# Altium project Maverick.PrjPCB
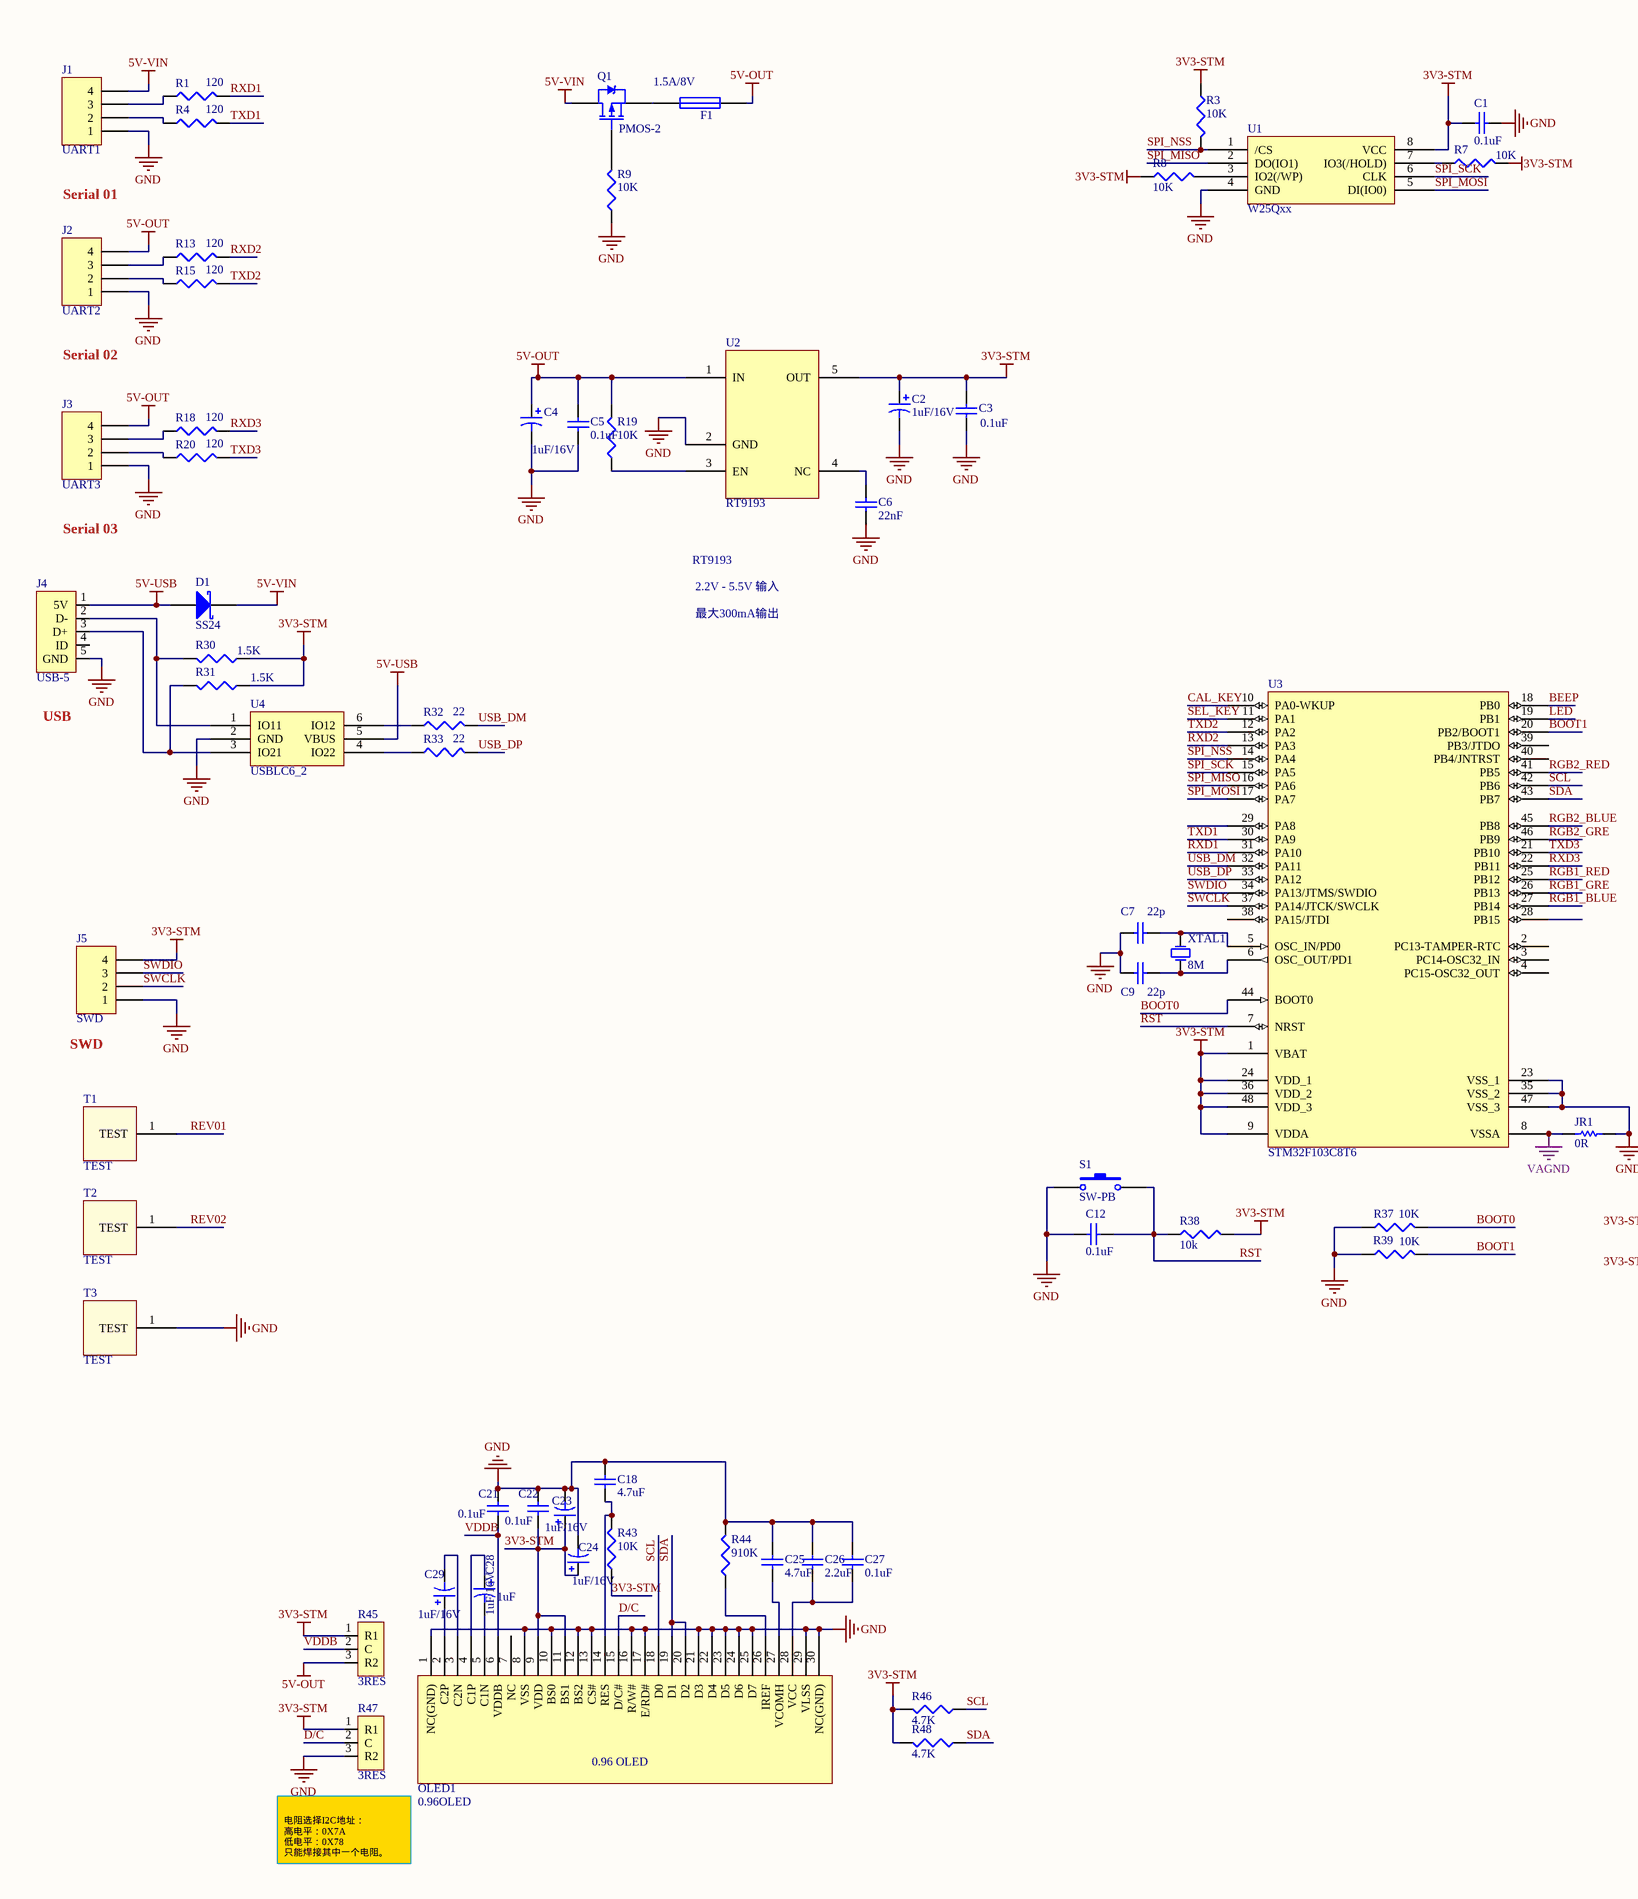
[diagram p0: MavSword_V1.0.SchDoc, left]
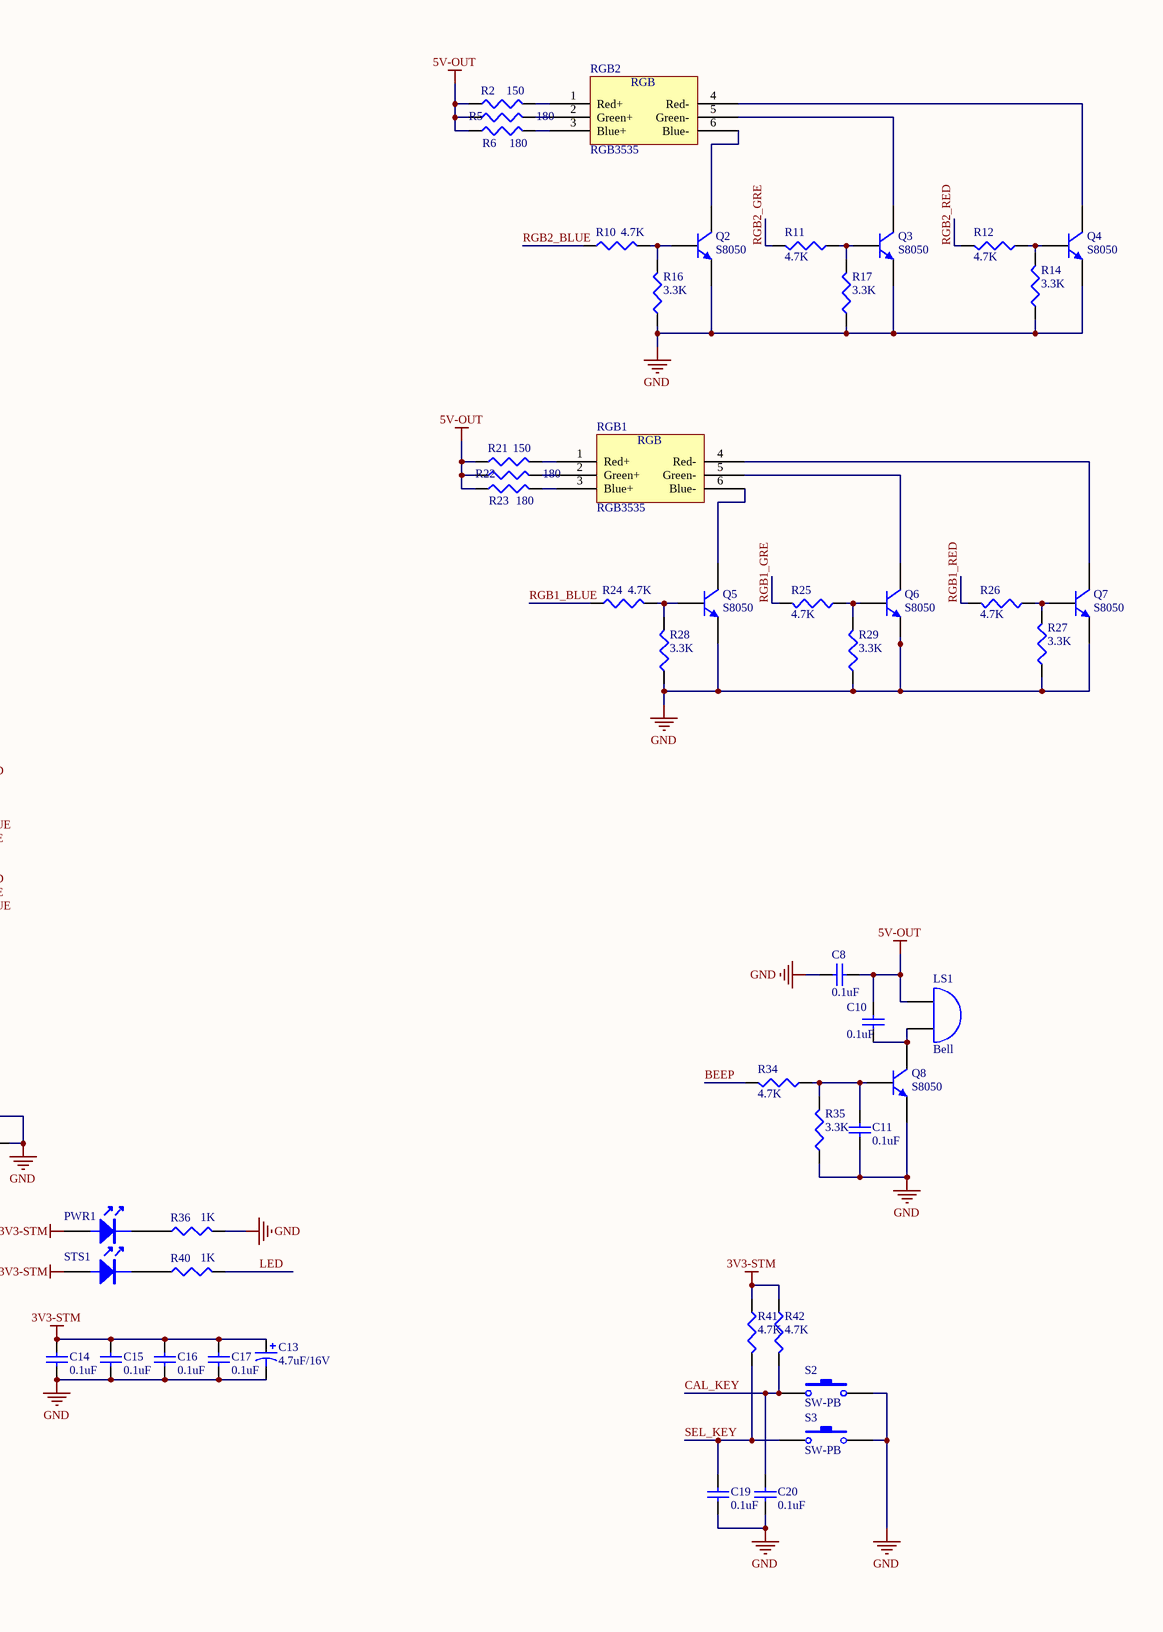
[diagram p1: MavSword_V1.0.SchDoc, right]
3 sheets, 240 parts. Net scope: global (net labels, ports and power ports of the same name join across sheets).
Board files: MavSword_V1.0.PcbDoc, car_V1.0.PcbDoc, hotV1.1.PcbDoc
Sheets:
  MavSword_V1.0.SchDoc
  hotV1.1.SchDoc
  Car.SchDoc

## Sheet MavSword_V1.0.SchDoc: MavSword
size A2; Author: AwesomeOY; DocumentNumber: 1; Revision: V1.0; SheetNumber: 1; SheetTotal: MavSword

### Parts
(Parts that share a designator on the sheet are numbered #1, #2 ... from top to bottom, then left to right.)
C1#1  0.1uF  [C0603B]
C2#1  1uF/16V  [C0603B]
C3#1  0.1uF  [C0603B]
C4#1  1uF/16V  [C0603B]
C5#1  0.1uF  [C0603B]
C6#1  22nF  [C0603B]
C7#1  22p  [C0603B]
C8#1  0.1uF  [C0603B]
C9#1  22p  [C0603B]
C10#1  0.1uF  [C0603B]
C11#1  0.1uF  [C0603B]
C12#1  0.1uF  [C0603B]
C13#1  4.7uF/16V  [C0603B]
C14#1  0.1uF  [C0603B]
C15#1  0.1uF  [C0603B]
C16#1  0.1uF  [C0603B]
C17#1  0.1uF  [C0603B]
C18#1  4.7uF  [C0603B]
C19#1  0.1uF  [C0603B]
C20#1  0.1uF  [C0603B]
C21#1  0.1uF  [C0603B]
C22#1  value 1uF/16V  [C0603B]  (hidden comment: 0.1uF)
C23#1  0.1uF  [C0603B]
C24#1  value 1uF/16V  [C0603B]  (hidden comment: Cap Pol1)
C25#1  4.7uF  [C0603B]
C26#1  2.2uF  [C0603B]
C27#1  0.1uF  [C0603B]
C28#1  1uF  value 1uF/16V  [C0603B]
C29#1  value 1uF/16V  [C0603B]  (hidden comment: Cap Pol1)
D1#1  SS24  [D1812]
F1#1  1.5A/8V  [1812]
J1#1  UART1  [SIPA4-1.27-SMT-H]
J2#1  UART2  [SIPA4-1.27-SMT-H]
J3#1  UART3  [SIPA4-1.27-SMT-H]
J4#1  USB-5  [MICRO-USB]
J5#1  SWD  [SIP4-1.27]
JR1#1  0R  [R0603B]
LS1#1  Bell  [BEEP12*7.5]
OLED1  0.96OLED  [0.96OLED]
PWR1#1  LED  [LED0805R]  (value not drawn)
Q1#1  PMOS-2  [SOT-23-3]
Q2#1  S8050  [SOT-23-3]
Q3#1  S8050  [SOT-23-3]
Q4#1  S8050  [SOT-23-3]
Q5#1  S8050  [SOT-23-3]
Q6  S8050  [SOT-23-3]
Q7  S8050  [SOT-23-3]
Q8  S8050  [SOT-23-3]
R1#1  120  [R0603B]
R2#1  150  [R0603B]
R3#1  10K  [R0603B]
R4#1  120  [R0603B]
R5#1  180  [R0603B]
R6#1  180  [R0603B]
R7#1  10K  [R0603B]
R8#1  10K  [R0603B]
R9#1  10K  [R0603B]
R10#1  4.7K  [R0603B]
R11  4.7K  [R0603B]
R12#1  4.7K  [R0603B]
R13#1  120  [R0603B]
R14#1  3.3K  [R0603B]
R15#1  120  [R0603B]
R16#1  3.3K  [R0603B]
R17#1  3.3K  [R0603B]
R18#1  120  [R0603B]
R19#1  10K  [R0603B]
R20#1  120  [R0603B]
R21#1  150  [R0603B]
R22#1  180  [R0603B]
R23#1  180  [R0603B]
R24#1  4.7K  [R0603B]
R25#1  4.7K  [R0603B]
R26#1  4.7K  [R0603B]
R27#1  3.3K  [R0603B]
R28#1  3.3K  [R0603B]
R29#1  3.3K  [R0603B]
R30#1  1.5K  [R0603B]
R31#1  1.5K  [R0603B]
R32#1  22  [R0603B]
R33#1  22  [R0603B]
R34#1  4.7K  [R0603B]
R35#1  3.3K  [R0603B]
R36#1  1K  [R0603B]
R37#1  10K  [R0603B]
R38#1  10k  [R0603B]
R39#1  10K  [R0603B]
R40#1  1K  [R0603B]
R41#1  4.7K  [R0603B]
R42#1  4.7K  [R0603B]
R43#1  10K  [R0603B]
R44  910K  [R0603B]
R45  3RES  [3JUMP0603*2]
R46  4.7K  [R0603B]
R47  3RES  [3JUMP0603*2]
R48  4.7K  [R0603B]
RGB1  RGB3535  [RGB3535]
RGB2  RGB3535  [RGB3535]
S1#1  SW-PB  [SW2PIN_8.2*3.5]
S2#1  SW-PB  [SW4PIN_9.2*6.15*9]
S3  SW-PB  [SW4PIN_9.2*6.15*9]
STS1#1  LED  [LED0805G]  (value not drawn)
T1#1  TEST  [TEST_POINT]
T2#1  TEST  [TEST_POINT]
T3#1  TEST  [TEST_POINT]
U1#1  W25Qxx  [SOIC-8_208mil]
U2#1  RT9193  [SOT23-5]
U3#1  STM32F103C8T6  [LQFP48_M_STM32]
U4#1  USBLC6_2  [SOT-23-6]
XTAL1#1  8M  [XL5032]

### Nets
3V3-STM: C1#1.2 C2#1.1 C3#1.1 C13#1.1 C14#1.2 C15#1.2 C16#1.2 C17#1.2 C22#1.1 C23#1.1 C24#1.1 J5#1.4 OLED1.9(VDD) OLED1.11(BS1) PWR1#1.1 R3#1.1 R7#1.2 R8#1.1 R30#1.1 R31#1.1 R38#1.1 R41#1.1 R42#1.1 R43#1.1 R45.1(R1) R46.2 R47.1(R1) R48.2 STS1#1.1 U1#1.8(VCC) U2#1.5(OUT) U3#1.1(VBAT) U3#1.9(VDDA) U3#1.24(VDD_1) U3#1.36(VDD_2) U3#1.48(VDD_3)
5V-OUT: C4#1.1 C5#1.2 C8#1.2 C10#1.2 F1#1.2 J2#1.4 J3#1.4 LS1#1.1(A) R2#1.1 R5#1.1 R6#1.1 R19#1.2 R21#1.1 R22#1.1 R23#1.1 R45.3(R2) U2#1.1(IN)
5V-USB: D1#1.1(A) J4#1.1(5V) U4#1.5(VBUS)
5V-VIN: D1#1.2(K) J1#1.4 Q1#1.2(D)
GND: C1#1.1 C2#1.2 C3#1.2 C4#1.2 C5#1.1 C6#1.1 C7#1.2 C8#1.1 C9#1.2 C11#1.1 C12#1.1 C13#1.2 C14#1.1 C15#1.1 C16#1.1 C17#1.1 C18#1.2 C19#1.1 C20#1.1 C21#1.2 C22#1.2 C23#1.2 C24#1.2 C25#1.2 C26#1.2 C27#1.1 J1#1.1 J2#1.1 J3#1.1 J4#1.5(GND) J5#1.1 JR1#1.2 OLED1.1(NC(GND)) OLED1.8(VSS) OLED1.10(BS0) OLED1.12(BS2) OLED1.13(CS#) OLED1.16(R/W#) OLED1.17(E/RD#) OLED1.21(D3) OLED1.22(D4) OLED1.23(D5) OLED1.24(D6) OLED1.25(D7) OLED1.29(VLSS) OLED1.30(NC(GND)) Q2#1.3(E) Q3#1.3(E) Q4#1.3(E) Q5#1.3(E) Q6.3(E) Q7.3(E) Q8.3(E) R9#1.1 R14#1.1 R16#1.1 R17#1.1 R27#1.1 R28#1.1 R29#1.1 R35#1.1 R36#1.2 R37#1.1 R39#1.1 R44.2 R47.3(R2) S1#1.1 S2#1.2 S3.2 T3#1.1(TEST) U1#1.4(GND) U2#1.2(GND) U3#1.23(VSS_1) U3#1.35(VSS_2) U3#1.47(VSS_3) U4#1.2(GND)
VAGND: JR1#1.1 U3#1.8(VSSA)
BEEP: R34#1.2 U3#1.18(PB0)
BOOT0: R37#1.2 U3#1.44(BOOT0)
BOOT1: R39#1.2 U3#1.20(PB2/BOOT1)
CAL_KEY: C20#1.2 R42#1.2 S2#1.1 U3#1.10(PA0-WKUP)
D/C: OLED1.15(D/C#) R47.2(C)
LED: R40#1.2 U3#1.19(PB1)
REV01: T1#1.1(TEST)
REV02: T2#1.1(TEST)
RGB1_BLUE: R24#1.1 U3#1.27(PB14)
RGB1_GRE: R25#1.2 U3#1.26(PB13)
RGB1_RED: R26#1.2 U3#1.25(PB12)
RGB2_BLUE: R10#1.1 U3#1.45(PB8)
RGB2_GRE: R11.2 U3#1.46(PB9)
RGB2_RED: R12#1.2 U3#1.41(PB5)
RST: C12#1.2 R38#1.2 S1#1.2 U3#1.7(NRST)
RXD1: R1#1.2 U3#1.31(PA10)
RXD2: R13#1.2 U3#1.13(PA3)
RXD3: R18#1.2 U3#1.22(PB11)
SCL: OLED1.18(D0) R46.1 U3#1.42(PB6)
SDA: OLED1.19(D1) OLED1.20(D2) R48.1 U3#1.43(PB7)
SEL_KEY: C19#1.2 R41#1.2 S3.1 U3#1.11(PA1)
SPI_MISO: U1#1.2(DO(IO1)) U3#1.16(PA6)
SPI_MOSI: U1#1.5(DI(IO0)) U3#1.17(PA7)
SPI_NSS: R3#1.2 U1#1.1(/CS) U3#1.14(PA4)
SPI_SCK: U1#1.6(CLK) U3#1.15(PA5)
SWCLK: J5#1.2 U3#1.37(PA14/JTCK/SWCLK)
SWDIO: J5#1.3 U3#1.34(PA13/JTMS/SWDIO)
TXD1: R4#1.2 U3#1.30(PA9)
TXD2: R15#1.2 U3#1.12(PA2)
TXD3: R20#1.2 U3#1.21(PB10)
USB_DM: R32#1.2 U3#1.32(PA11)
USB_DP: R33#1.2 U3#1.33(PA12)
VDDB: C21#1.1 OLED1.6(VDDB) R45.2(C)
NetC6#1_2: C6#1.2 U2#1.4(NC)
NetC7#1_1: C7#1.1 U3#1.5(OSC_IN/PD0) XTAL1#1.2(OSC2)
NetC9#1_1: C9#1.1 U3#1.6(OSC_OUT/PD1) XTAL1#1.1(OSC1)
NetC10#1_1: C10#1.1 LS1#1.2(B) Q8.2(C)
NetC11#1_2: C11#1.2 Q8.1(B) R34#1.1 R35#1.2
NetC18#1_1: C18#1.1 OLED1.14(RES) R43#1.2
NetC25#1_1: C25#1.1 OLED1.27(VCOMH)
NetC26#1_1: C26#1.1 C27#1.2 OLED1.28(VCC)
NetC28#1_1: C28#1.1 OLED1.4(C1P)
NetC28#1_2: C28#1.2 OLED1.5(C1N)
NetC29#1_1: C29#1.1 OLED1.2(C2P)
NetC29#1_2: C29#1.2 OLED1.3(C2N)
NetF1#1_1: F1#1.1 Q1#1.3(S)
NetJ1#1_2: J1#1.2 R4#1.1
NetJ1#1_3: J1#1.3 R1#1.1
NetJ2#1_2: J2#1.2 R15#1.1
NetJ2#1_3: J2#1.3 R13#1.1
NetJ3#1_2: J3#1.2 R20#1.1
NetJ3#1_3: J3#1.3 R18#1.1
NetJ4#1_2: J4#1.2(D-) R30#1.2 U4#1.1(IO11)
NetJ4#1_3: J4#1.3(D+) R31#1.2 U4#1.3(IO21)
NetOLED1_26: OLED1.26(IREF) R44.1
NetPWR1#1_2: PWR1#1.2 R36#1.1
NetQ1#1_1: Q1#1.1(G) R9#1.2
NetQ2#1_1: Q2#1.1(B) R10#1.2 R16#1.2
NetQ2#1_2: Q2#1.2(C) RGB2.6(Blue-)
NetQ3#1_1: Q3#1.1(B) R11.1 R17#1.2
NetQ3#1_2: Q3#1.2(C) RGB2.5(Green-)
NetQ4#1_1: Q4#1.1(B) R12#1.1 R14#1.2
NetQ4#1_2: Q4#1.2(C) RGB2.4(Red-)
NetQ5#1_1: Q5#1.1(B) R24#1.2 R28#1.2
NetQ5#1_2: Q5#1.2(C) RGB1.6(Blue-)
NetQ6_1: Q6.1(B) R25#1.1 R29#1.2
NetQ6_2: Q6.2(C) RGB1.5(Green-)
NetQ7_1: Q7.1(B) R26#1.1 R27#1.2
NetQ7_2: Q7.2(C) RGB1.4(Red-)
NetR2#1_2: R2#1.2 RGB2.1(Red+)
NetR5#1_2: R5#1.2 RGB2.2(Green+)
NetR6#1_2: R6#1.2 RGB2.3(Blue+)
NetR7#1_1: R7#1.1 U1#1.7(IO3(/HOLD))
NetR8#1_2: R8#1.2 U1#1.3(IO2(/WP))
NetR19#1_1: R19#1.1 U2#1.3(EN)
NetR21#1_2: R21#1.2 RGB1.1(Red+)
NetR22#1_2: R22#1.2 RGB1.2(Green+)
NetR23#1_2: R23#1.2 RGB1.3(Blue+)
NetR32#1_1: R32#1.1 U4#1.6(IO12)
NetR33#1_1: R33#1.1 U4#1.4(IO22)
NetR40#1_1: R40#1.1 STS1#1.2

Not connected (* = marked no-connect by the designer): J4#1 4(ID); OLED1 7(NC); U3#1 2(PC13-TAMPER-RTC) 3(PC14-OSC32_IN) 4(PC15-OSC32_OUT) 28(PB15) 29(PA8) 38(PA15/JTDI) 39(PB3/JTDO) 40(PB4/JNTRST)

### Notes on the sheet
- Serial 01
- Serial 02
- Serial 03
- RT9193
  2.2V - 5.5V 输入
  最大300mA输出
- (near J4#1) USB
- (near J5#1) SWD
- (near R47) 电阻选择I2C地址：
  高电平：0X7A
  低电平：0X78
  只能焊接其中一个电阻。
- Title
- Size:
- Date:
- File:
- A2
- Number:
- Time:
- Revision:
- Sheet
- of
- (in symbol 0.96OLED) 0.96 OLED
- (in symbol RGB3535) RGB

### Library data of the parts
C1#1 C3#1 C5#1 C6#1 C8#1 C10#1 C11#1 C12#1 C14#1 C15#1 C16#1 C17#1 C19#1 C20#1 C21#1 C23#1 C27#1 = Cap: Capacitor; Published: 8-Jun-2000; LatestRevisionDate: 17-Jul-2002; LatestRevisionNote: Re-released for DXP Platform.; PackageReference: RAD-0.3; Publisher: Altium Limited
  C1#1 C3#1 C5#1 C8#1 C10#1 C11#1 C12#1 C14#1 C15#1 C16#1 C17#1 C19#1 C20#1 C21#1 C23#1 C27#1: Value: 0.1uF
  C6#1: Value: 22nF
C2#1 C4#1 C13#1 C22#1 C24#1 C28#1 C29#1 = Cap Pol1: Polarized Capacitor (Radial); Published: 8-Jun-2000; LatestRevisionDate: 17-Jul-2002; LatestRevisionNote: Re-released for DXP Platform.; PackageReference: RB7.6-15; Publisher: Altium Limited
  C2#1 C4#1: Value: 1uF/16V
  C13#1: Value: 4.7uF/16V
  C22#1 C24#1 C28#1 C29#1: PackageDescription: Polarized Capacitor (Radial); 2 Leads
C7#1 C9#1 = Cap: Capacitor; Value: 22pF; Published: 8-Jun-2000; LatestRevisionDate: 17-Jul-2002; LatestRevisionNote: Re-released for DXP Platform.; PackageReference: RAD-0.3; Publisher: Altium Limited
C18#1 C25#1 = Cap: Capacitor; Value: 4.7uF/16V; Published: 8-Jun-2000; LatestRevisionDate: 17-Jul-2002; LatestRevisionNote: Re-released for DXP Platform.; PackageReference: RAD-0.3; Publisher: Altium Limited
C26#1 = Cap: Capacitor; Value: 2.2uF/16V; Published: 8-Jun-2000; LatestRevisionDate: 17-Jul-2002; LatestRevisionNote: Re-released for DXP Platform.; PackageReference: RAD-0.3; Publisher: Altium Limited
D1#1 = D Schottky: Schottky Diode; Published: 8-Jun-2000; LatestRevisionDate: 17-Jul-2002; LatestRevisionNote: Re-released for DXP Platform.; PackageReference: SMB; Publisher: Altium Limited; PackageDescription: DO-214-AA/SMB; 2 C-Bend Leads; Body 5.3 x 3.6 mm, inc. leads (LxW); Code_JEDEC: DO-214-AA
F1#1 = Fuse 1: Fuse; Published: 8-Jun-2000; LatestRevisionDate: 17-Jul-2002; LatestRevisionNote: Re-released for DXP Platform.; PackageReference: PIN-W2/E2.8; Publisher: Altium Limited; PackageDescription: Thru-Hole; 2 Leads
J1#1 J2#1 J3#1 J5#1 = Header 4: Header, 4-Pin; LatestRevisionDate: 17-Jul-2002; LatestRevisionNote: Re-released for DXP Platform.; Publisher: Altium Limited
J4#1 = USB5
JR1#1 = Res1: Resistor; Value: 0; Published: 8-Jun-2000; LatestRevisionDate: 17-Jul-2002; LatestRevisionNote: Re-released for DXP Platform.; PackageReference: AXIAL-0.3; Publisher: Altium Limited; PackageDescription: Axial Device, Thru-Hole; 2 Leads; 0.3 in Pin Spacing
LS1#1 = Bell: Electrical Bell; Published: 24-Mar-1999; LatestRevisionDate: 17-Jul-2002; LatestRevisionNote: Re-released for DXP Platform.; PackageReference: PIN2; Publisher: Altium Limited
Q1#1 = PMOS-2: P-Channel Power MOSFET; Note: Pin 4 not drawn and electrically connected to Pin 2.; Published: 8-Jun-2000; LatestRevisionDate: 17-Jul-2002; LatestRevisionNote: Re-released for DXP Platform.; DatasheetVersion: PD-9.390D; PackageVersion: Feb-1997; PackageReference: TO-220AB; Publisher: Altium Limited; PackageDescription: TO, Thru-Hole, Vertical, Heatsink Mounted; 3 In-Line Leads; Pitch 2.54 mm; ComponentLink1Description: Manufacturer Link; ComponentLink1URL: http://www.irf.com/
Q2#1 Q3#1 Q4#1 Q5#1 Q6-Q8 = NPN: NPN Bipolar Transistor; Published: 8-Jun-2000; LatestRevisionDate: 17-Jul-2002; LatestRevisionNote: Re-released for DXP Platform.; PackageReference: TO-226-AA; Publisher: Altium Limited; PackageDescription: TO, Flat Index; 3 In-Line, Axial Leads; Body Dia. 4.8mm; Leads 0.55 x 0.51 mm (max); Code_JEDEC: TO-226-AA
R1#1 R2#1 R3#1 R4#1 R5#1 R6#1 R7#1 R8#1 R9#1 R10#1 R11 R12#1 R13#1 R14#1 R15#1 R16#1 R17#1 R18#1 R19#1 R20#1 R21#1 R22#1 R23#1 R24#1 R25#1 R26#1 R27#1 R28#1 R29#1 R30#1 R31#1 R32#1 R33#1 R34#1 R35#1 R36#1 R37#1 R38#1 R39#1 R40#1 R41#1 R42#1 R43#1 R44 R46 R48 = Res3: Resistor; Published: 8-Jun-2000; LatestRevisionDate: 29-May-2009; LatestRevisionNote: IPC-7351 Footprint Added.; PackageReference: J1-0603; Publisher: Altium Limited; PackageDescription: Chip Resistor
  R1#1 R4#1 R13#1 R15#1 R18#1 R20#1: Value: 120
  R2#1 R21#1: Value: 150
  R3#1 R7#1 R8#1 R9#1 R19#1 R37#1 R38#1 R39#1 R43#1: Value: 10K
  R5#1 R6#1 R22#1 R23#1: Value: 180
  R10#1 R11 R12#1 R24#1 R25#1 R26#1 R34#1 R41#1 R42#1 R46 R48: Value: 4.7K
  R14#1 R16#1 R17#1 R27#1 R28#1 R29#1 R35#1: Value: 3.3K
  R30#1 R31#1: Value: 1.5K
  R32#1 R33#1: Value: 22
  R36#1 R40#1: Value: 1K
  R44: Value: 910K
R45 = 3JumpR: value: 0
R47 = 3JumpR: value: 4.7
S1#1 S2#1 S3 = SW-PB: Switch; Published: 24-Mar-1999; LatestRevisionDate: 17-Jul-2002; LatestRevisionNote: Re-released for DXP Platform.; PackageReference: SPST-2; Publisher: Altium Limited; PackageDescription: Switch; 2 Leads
T1#1 T2#1 T3#1 = TEST_POINT
U2#1 = TLV70033
U3#1 = STM32F101C8T6: STM32 ARM-based 32-bit MCU with 64 Kbytes Flash, 48-pin LQFP, Industrial Temperature; Published: 30-May-2008; DatasheetVersion: rev6, Mar-2008; PackageVersion: Mar-2008; PackageReference: LQFP48; Publisher: Altium Limited; PackageDescription: 48-Pin Low-Profile Quad Flat Pack, 7 x 7 mm Body, 0.5 mm Pitch (LQFP48); ComponentLink1Description: Manufacturer Link; ComponentLink1URL: www.st.com/stm32; ComponentLink2Description: Datasheet; ComponentLink2URL: http://www.st.com/stonline/products/literature/ds/13586.pdf
XTAL1#1 = XTAL: Crystal Oscillator; Published: 8-Jun-2000; LatestRevisionDate: 17-Jul-2002; LatestRevisionNote: Re-released for DXP Platform.; PackageReference: R38; Publisher: Altium Limited

## Sheet hotV1.1.SchDoc
size A2
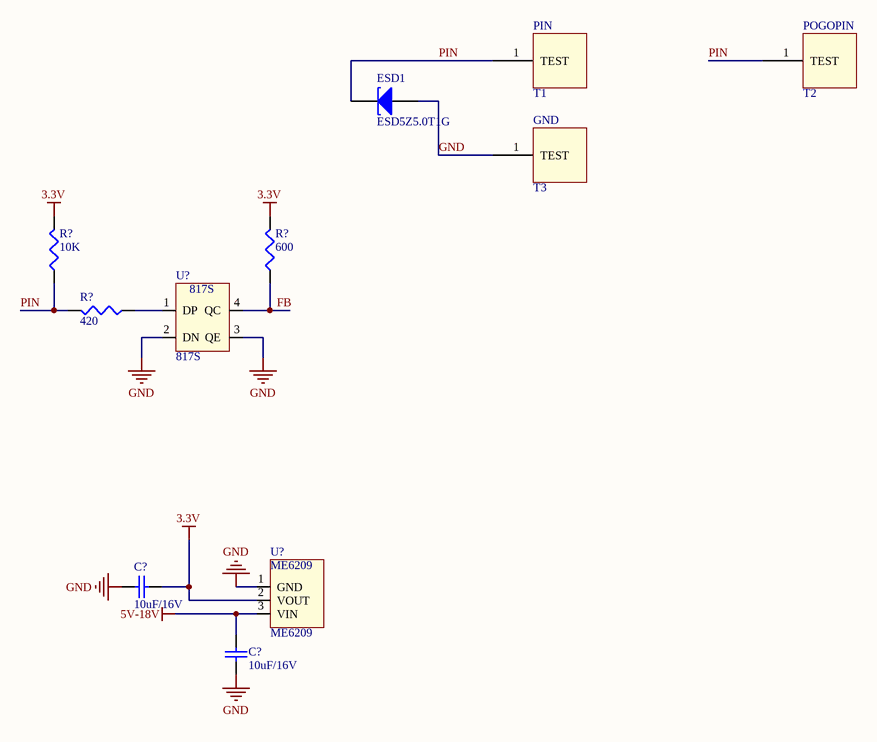
[diagram p2: hotV1.1.SchDoc]

### Parts
(Parts that share a designator on the sheet are numbered #1, #2 ... from top to bottom, then left to right.)
C?#1  10uF/16V  [C0603B]
C?#2  10uF/16V  [C0603B]
ESD1  ESD5Z5.0T1G  [LC-SOD-523]
GND  T3  [PIN]
PIN  T1  [PIN]
POGOPIN  T2  [POGOPIN]
R?#1  10K  [R0603B]
R?#2  600  [R0603B]
R?#3  420  [R0603B]
U?#1  817S
U?#2  ME6209

### Nets
3.3V: C?#1.1 R?#1.2 R?#2.2 U?#2.2(VOUT)
5V-18V: C?#2.2 U?#2.3(VIN)
GND: C?#1.2 C?#2.1 ESD1.1(A) GND.1(TEST) U?#1.2(DN) U?#1.3(QE) U?#2.1(GND)
FB: R?#2.1 U?#1.4(QC)
PIN: ESD1.2(K) PIN.1(TEST) POGOPIN.1(TEST) R?#1.1 R?#3.2
NetR?#3_1: R?#3.1 U?#1.1(DP)

### Library data of the parts
C?#1 C?#2 = Cap: Capacitor; Value: 0.1uF; Published: 8-Jun-2000; LatestRevisionDate: 17-Jul-2002; LatestRevisionNote: Re-released for DXP Platform.; PackageReference: RAD-0.3; Publisher: Altium Limited
ESD1 = D Tunnel2: Tunnel Diode - Dependent Source Model; Published: 15-Apr-2002; LatestRevisionDate: 17-Jul-2002; LatestRevisionNote: Re-released for DXP Platform.; PackageReference: DIODE-0.4; Publisher: Altium Limited; PackageDescription: Diode, Thru-Hole; 2 Leads; 0.4 in Pin Spacing
GND PIN POGOPIN = TEST_POINT
R?#1 = Res3: Resistor; Published: 8-Jun-2000; LatestRevisionDate: 29-May-2009; LatestRevisionNote: IPC-7351 Footprint Added.; PackageReference: J1-0603; Publisher: Altium Limited; Value: 10K; PackageDescription: Chip Resistor
R?#2 R?#3 = Res3: Resistor; Value: 10K; Published: 8-Jun-2000; LatestRevisionDate: 29-May-2009; LatestRevisionNote: IPC-7351 Footprint Added.; PackageReference: J1-0603; Publisher: Altium Limited; PackageDescription: Chip Resistor
U?#1 = 817S: 光耦芯片
U?#2 = ME6209: LDO芯片   VIN-16V OUT-3.3V  200ma

## Sheet Car.SchDoc
size A2
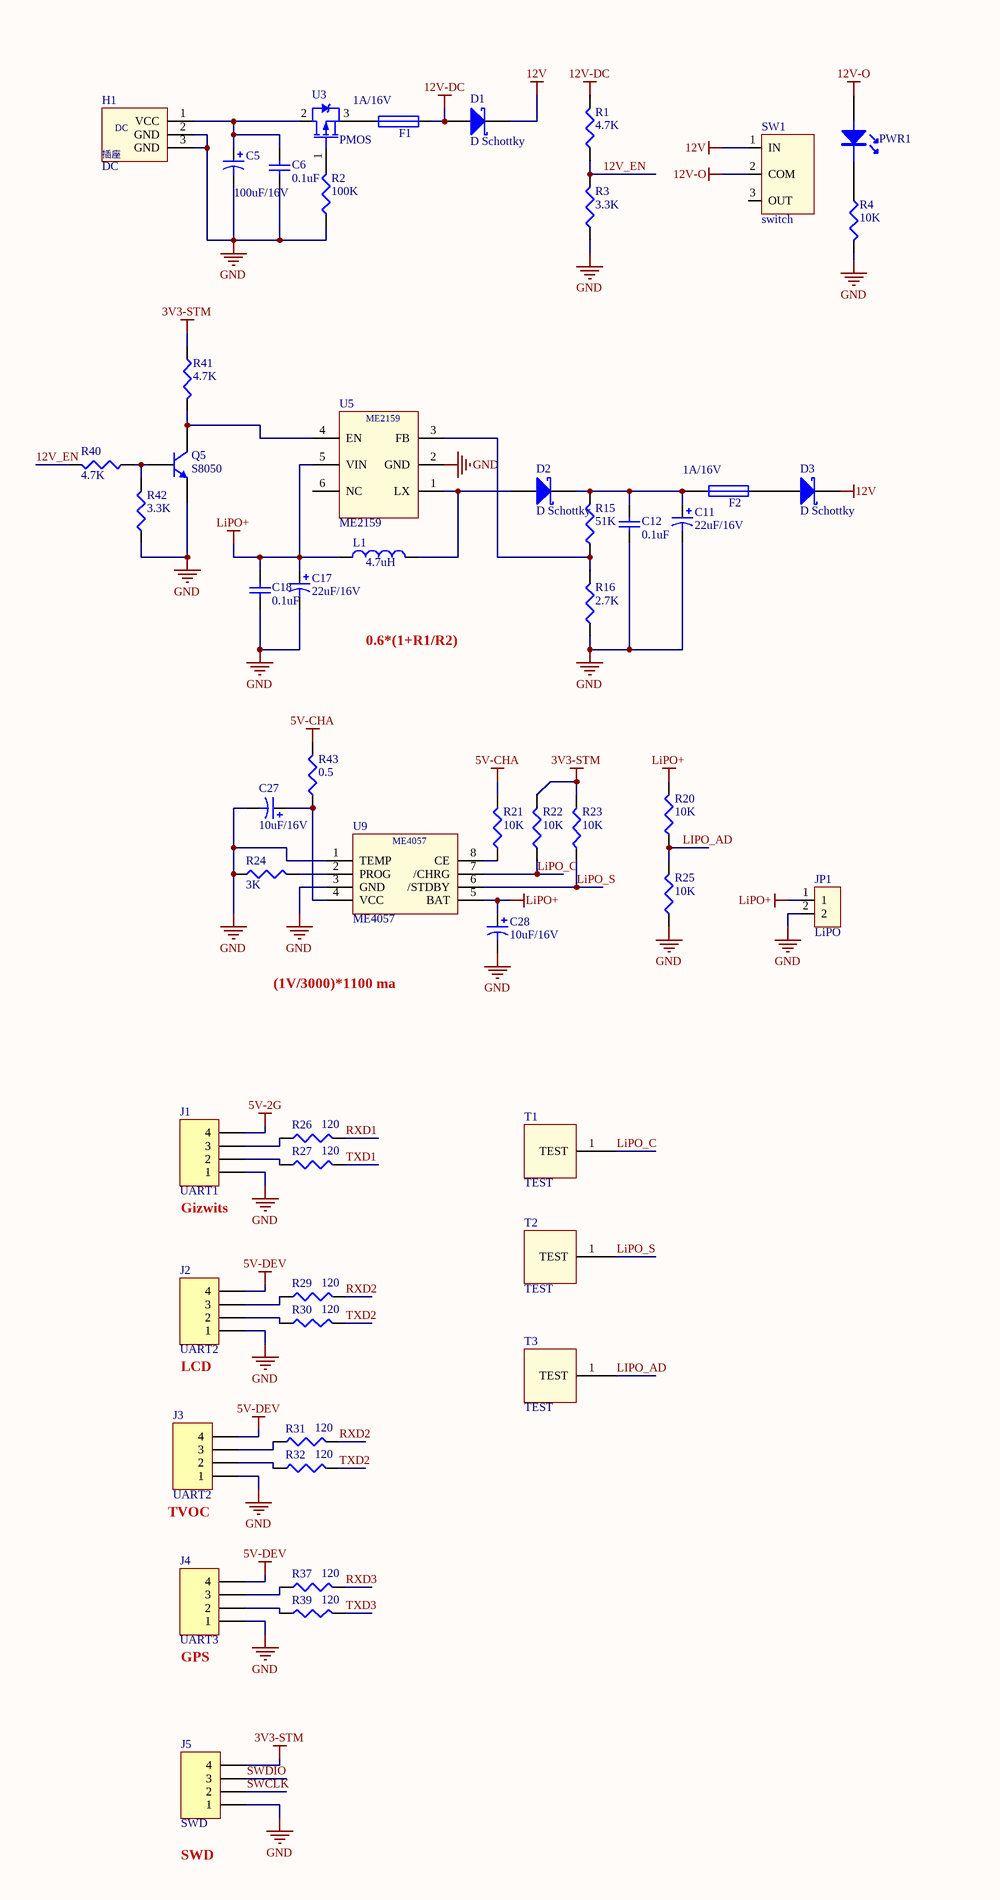
[diagram p3: Car.SchDoc, left]
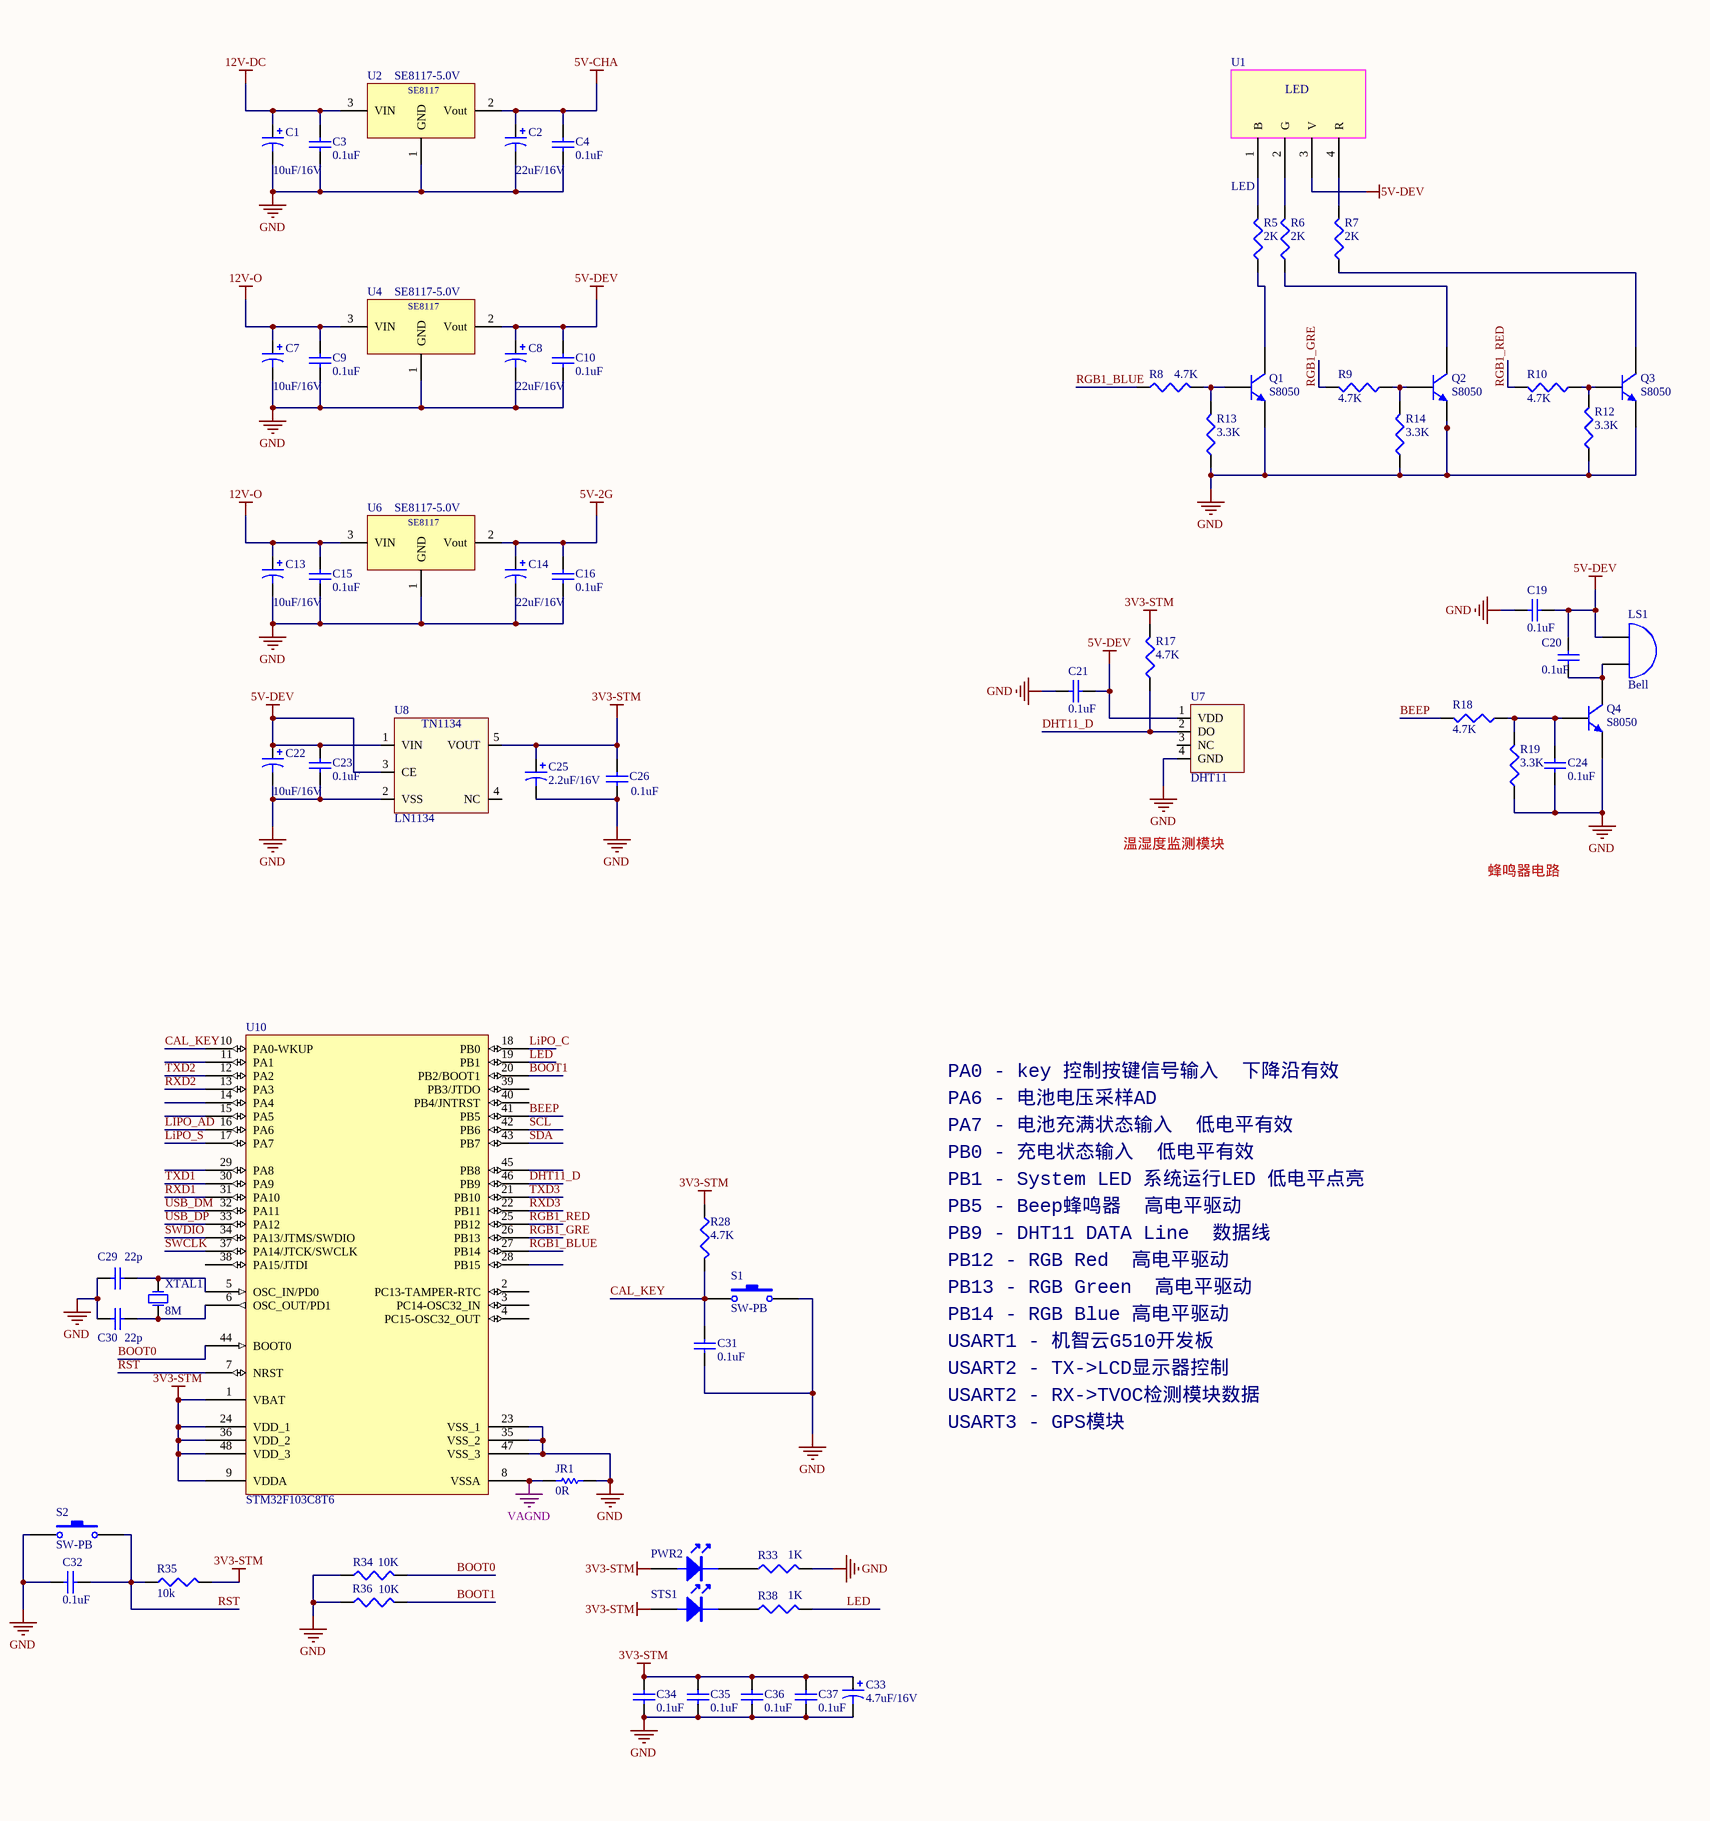
[diagram p4: Car.SchDoc, right]

### Parts
(Parts that share a designator on the sheet are numbered #1, #2 ... from top to bottom, then left to right.)
C1#2  10uF/16V  [C1206C]
C2#2  22uF/16V  [C1206C]
C3#2  0.1uF  [C0603B]
C4#2  0.1uF  [C0603B]
C5#2  100uF/16V  [CAP_6.3*7]
C6#2  0.1uF  [C0603B]
C7#2  10uF/16V  [C1206C]
C8#2  22uF/16V  [C1206C]
C9#2  0.1uF  [C0603B]
C10#2  0.1uF  [C0603B]
C11#2  22uF/16V  [C1206C]
C12#2  0.1uF  [C0603B]
C13#2  10uF/16V  [C1206C]
C14#2  22uF/16V  [C1206C]
C15#2  0.1uF  [C0603B]
C16#2  0.1uF  [C0603B]
C17#2  22uF/16V  [C1206C]
C18#2  0.1uF  [C0603B]
C19#2  0.1uF  [C0603B]
C20#2  0.1uF  [C0603B]
C21#2  0.1uF  [C0603B]
C22#2  10uF/16V  [C1206C]
C23#2  0.1uF  [C0603B]
C24#2  0.1uF  [C0603B]
C25#2  2.2uF/16V  [C1206C]
C26#2  0.1uF  [C0603B]
C27#2  10uF/16V  [C1206C]
C28#2  10uF/16V  [C1206C]
C29#2  22p  [C0603B]
C30  22p  [C0603B]
C31  0.1uF  [C0603B]
C32  0.1uF  [C0603B]
C33  4.7uF/16V  [C1206C]
C34  0.1uF  [C0603B]
C35  0.1uF  [C0603B]
C36  0.1uF  [C0603B]
C37  0.1uF  [C0603B]
D1#2  D Schottky  [DO-214AC]
D2  D Schottky  [DO-214AC]
D3  D Schottky  [DO-214AC]
F1#2  1A/16V  [LC-1206_L]
F2  1A/16V  [LC-1206_L]
H1  DC  [DC_2.1]
J1#2  UART1  [SIPA4-1.27-SMT-H]
J2#2  UART2  [SIPA4-1.27-SMT-H]
J3#2  UART2  [SIPA4-1.27-SMT-H]
J4#2  UART3  [SIPA4-1.27-SMT-H]
J5#2  SWD  [SIP4-1.27]
JP1  LiPO  [LiPO_2PIN]
JR1#2  0R  [0JUMP0603]
L1  value 4.7uH  [L-6X6X3]  (hidden comment: Inductor)
LS1#2  Bell  [BEEP12*7.5]
PWR1#2  LED  [LED0805R]  (value not drawn)
PWR2  LED  [LED0805R]  (value not drawn)
Q1#2  S8050  [SOT-23-3]
Q2#2  S8050  [SOT-23-3]
Q3#2  S8050  [SOT-23-3]
Q4#2  S8050  [SOT-23-3]
Q5#2  S8050  [SOT-23-3]
R1#2  4.7K  [R0603B]
R2#2  100K  [R0603B]
R3#2  3.3K  [R0603B]
R4#2  10K  [R0603B]
R5#2  2K  [R0603B]
R6#2  2K  [R0603B]
R7#2  2K  [R0603B]
R8#2  4.7K  [R0603B]
R9#2  4.7K  [R0603B]
R10#2  4.7K  [R0603B]
R12#2  3.3K  [R0603B]
R13#2  3.3K  [R0603B]
R14#2  3.3K  [R0603B]
R15#2  51K  [R0603B]
R16#2  2.7K  [R0603B]
R17#2  4.7K  [R0603B]
R18#2  4.7K  [R0603B]
R19#2  3.3K  [R0603B]
R20#2  10K  [R0603B]
R21#2  10K  [R0603B]
R22#2  10K  [R0603B]
R23#2  10K  [R0603B]
R24#2  3K  [R0603B]
R25#2  10K  [R0603B]
R26#2  120  [R0603B]
R27#2  120  [R0603B]
R28#2  4.7K  [R0603B]
R29#2  120  [R0603B]
R30#2  120  [R0603B]
R31#2  120  [R0603B]
R32#2  120  [R0603B]
R33#2  1K  [R0603B]
R34#2  10K  [R0603B]
R35#2  10k  [R0603B]
R36#2  10K  [R0603B]
R37#2  120  [R0603B]
R38#2  1K  [R0603B]
R39#2  120  [R0603B]
R40#2  4.7K  [R0603B]
R41#2  4.7K  [R0603B]
R42#2  3.3K  [R0603B]
R43#2  0.5  [R2010]
S1#2  SW-PB  [ce_switch_4.5*4.5*4.8]
S2#2  SW-PB  [ce_switch_4.5*4.5*4.8]
STS1#2  LED  [LED0805G]  (value not drawn)
SW1  switch  [SW_SK-12E12]
T1#2  TEST  [TEST_POINT]
T2#2  TEST  [TEST_POINT]
T3#2  TEST  [TEST_POINT]
U1#2  LED  [5MM-LED]
U2#2  SE8117-5.0V  [LC-SOT-223]
U3#2  PMOS  [SOT-23-3]
U4#2  SE8117-5.0V  [LC-SOT-223]
U5  ME2159  [LC-SOT-23-6]
U6  SE8117-5.0V  [LC-SOT-223]
U7  DHT11  [DHT11-4PIN]
U8  LN1134  [LC-SOT-23-5]
U9  ME4057  [LC-SOP-8_EP_150mil]
U10  STM32F103C8T6  [LQFP48_M_STM32]
XTAL1#2  8M  [XL5032]

### Nets
3V3-STM: C25#2.1 C26#2.1 C33.1 C34.2 C35.2 C36.2 C37.2 J5#2.4 PWR2.1 R17#2.2 R22#2.2 R23#2.2 R28#2.1 R35#2.1 R41#2.1 STS1#2.1 U8.5(VOUT) U10.1(VBAT) U10.9(VDDA) U10.24(VDD_1) U10.36(VDD_2) U10.48(VDD_3)
5V-2G: C14#2.1 C16#2.2 J1#2.4 U6.2(Vout)
5V-CHA: C2#2.1 C4#2.2 R21#2.2 R43#2.2 U2#2.2(Vout)
5V-DEV: C8#2.1 C10#2.2 C19#2.2 C20#2.2 C21#2.2 C22#2.1 C23#2.2 J2#2.4 J3#2.4 J4#2.4 LS1#2.1(A) U1#2.3(V) U4#2.2(Vout) U7.1(VDD) U8.1(VIN) U8.3(CE)
12V: D1#2.2(K) D3.2(K) SW1.1(IN)
12V-DC: C1#2.1 C3#2.2 D1#2.1(A) F1#2.2 R1#2.2 U2#2.3(VIN)
12V-O: C7#2.1 C9#2.2 C13#2.1 C15#2.2 PWR1#2.1 SW1.2(COM) U4#2.3(VIN) U6.3(VIN)
GND: C1#2.2 C2#2.2 C3#2.1 C4#2.1 C5#2.2 C6#2.1 C7#2.2 C8#2.2 C9#2.1 C10#2.1 C11#2.2 C12#2.1 C13#2.2 C14#2.2 C15#2.1 C16#2.1 C17#2.2 C18#2.1 C19#2.1 C21#2.1 C22#2.2 C23#2.1 C24#2.1 C25#2.2 C26#2.2 C27#2.2 C28#2.2 C29#2.2 C30.2 C31.1 C32.1 C33.2 C34.1 C35.1 C36.1 C37.1 H1.2(GND) H1.3(GND) J1#2.1 J2#2.1 J3#2.1 J4#2.1 J5#2.1 JP1.2 JR1#2.2 Q1#2.3(E) Q2#2.3(E) Q3#2.3(E) Q4#2.3(E) Q5#2.3(E) R2#2.1 R3#2.1 R4#2.2 R12#2.1 R13#2.1 R14#2.1 R16#2.1 R19#2.1 R24#2.1 R25#2.1 R33#2.2 R34#2.1 R36#2.1 R42#2.1 S1#2.2 S2#2.1 U2#2.1(GND) U4#2.1(GND) U5.2(GND) U6.1(GND) U7.4(GND) U8.2(VSS) U9.1(TEMP) U9.3(GND) U10.23(VSS_1) U10.35(VSS_2) U10.47(VSS_3)
LiPO+: C17#2.1 C18#2.2 C28#2.1 JP1.1 L1.1 R20#2.2 U5.5(VIN) U9.5(BAT)
VAGND: JR1#2.1 U10.8(VSSA)
12V_EN: R1#2.1 R3#2.2 R40#2.2
BEEP: R18#2.2 U10.41(PB5)
BOOT0: R34#2.2 U10.44(BOOT0)
BOOT1: R36#2.2 U10.20(PB2/BOOT1)
CAL_KEY: C31.2 R28#2.2 S1#2.1 U10.10(PA0-WKUP)
DHT11_D: R17#2.1 U7.2(DO) U10.46(PB9)
LED: R38#2.2 U10.19(PB1)
LIPO_AD: R20#2.1 R25#2.2 T3#2.1(TEST) U10.16(PA6)
LiPO_C: R22#2.1 T1#2.1(TEST) U9.7(/CHRG) U10.18(PB0)
LiPO_S: R23#2.1 T2#2.1(TEST) U9.6(/STDBY) U10.17(PA7)
RGB1_BLUE: R8#2.1 U10.27(PB14)
RGB1_GRE: R9#2.2 U10.26(PB13)
RGB1_RED: R10#2.2 U10.25(PB12)
RST: C32.2 R35#2.2 S2#2.2 U10.7(NRST)
RXD1: R26#2.2 U10.31(PA10)
RXD2: R29#2.2 R31#2.2 U10.13(PA3)
RXD3: R37#2.2 U10.22(PB11)
SCL: U10.42(PB6)
SDA: U10.43(PB7)
SWCLK: J5#2.2 U10.37(PA14/JTCK/SWCLK)
SWDIO: J5#2.3 U10.34(PA13/JTMS/SWDIO)
TXD1: R27#2.2 U10.30(PA9)
TXD2: R30#2.2 R32#2.2 U10.12(PA2)
TXD3: R39#2.2 U10.21(PB10)
USB_DM: U10.32(PA11)
USB_DP: U10.33(PA12)
NetC5#2_1: C5#2.1 C6#2.2 H1.1(VCC) U3#2.2(D)
NetC11#2_1: C11#2.1 C12#2.2 D2.2(K) F2.1 R15#2.2
NetC20#2_1: C20#2.1 LS1#2.2(B) Q4#2.2(C)
NetC24#2_2: C24#2.2 Q4#2.1(B) R18#2.1 R19#2.2
NetC27#2_1: C27#2.1 R43#2.1 U9.4(VCC)
NetC29#2_1: C29#2.1 U10.5(OSC_IN/PD0) XTAL1#2.2(OSC2)
NetC30_1: C30.1 U10.6(OSC_OUT/PD1) XTAL1#2.1(OSC1)
NetD2_1: D2.1(A) L1.2 U5.1(LX)
NetD3_1: D3.1(A) F2.2
NetF1#2_1: F1#2.1 U3#2.3(S)
NetJ1#2_2: J1#2.2 R27#2.1
NetJ1#2_3: J1#2.3 R26#2.1
NetJ2#2_2: J2#2.2 R30#2.1
NetJ2#2_3: J2#2.3 R29#2.1
NetJ3#2_2: J3#2.2 R32#2.1
NetJ3#2_3: J3#2.3 R31#2.1
NetJ4#2_2: J4#2.2 R39#2.1
NetJ4#2_3: J4#2.3 R37#2.1
NetPWR1#2_2: PWR1#2.2 R4#2.1
NetPWR2_2: PWR2.2 R33#2.1
NetQ1#2_1: Q1#2.1(B) R8#2.2 R13#2.2
NetQ1#2_2: Q1#2.2(C) R5#2.1
NetQ2#2_1: Q2#2.1(B) R9#2.1 R14#2.2
NetQ2#2_2: Q2#2.2(C) R6#2.1
NetQ3#2_1: Q3#2.1(B) R10#2.1 R12#2.2
NetQ3#2_2: Q3#2.2(C) R7#2.1
NetQ5#2_1: Q5#2.1(B) R40#2.1 R42#2.2
NetQ5#2_2: Q5#2.2(C) R41#2.2 U5.4(EN)
NetR2#2_2: R2#2.2 U3#2.1(G)
NetR5#2_2: R5#2.2 U1#2.1(B)
NetR6#2_2: R6#2.2 U1#2.2(G)
NetR7#2_2: R7#2.2 U1#2.4(R)
NetR15#2_1: R15#2.1 R16#2.2 U5.3(FB)
NetR21#2_1: R21#2.1 U9.8(CE)
NetR24#2_2: R24#2.2 U9.2(PROG)
NetR38#2_1: R38#2.1 STS1#2.2

Not connected (* = marked no-connect by the designer): SW1 3(OUT); U5 6(NC); U7 3(NC); U8 4(NC); U10 2(PC13-TAMPER-RTC) 3(PC14-OSC32_IN) 4(PC15-OSC32_OUT) 11(PA1) 14(PA4) 15(PA5) 28(PB15) 29(PA8) 38(PA15/JTDI) 39(PB3/JTDO) 40(PB4/JNTRST) 45(PB8)

### Notes on the sheet
- 0.6*(1+R1/R2)
- 温湿度监测模块
- 蜂鸣器电路
- (1V/3000)*1100 ma
- PA0 - key 控制按键信号输入  下降沿有效
- PA6 - 电池电压采样AD
- PA7 - 电池充满状态输入  低电平有效
- PB1 - System LED 系统运行LED 低电平点亮
- PB0 - 充电状态输入  低电平有效
- (near J1#2) Gizwits
- PB5 - Beep蜂鸣器  高电平驱动
- PB9 - DHT11 DATA Line  数据线
- PB12 - RGB Red  高电平驱动
- PB13 - RGB Green  高电平驱动
- PB14 - RGB Blue 高电平驱动
- (near J2#2) LCD
- USART1 - 机智云G510开发板
- USART2 - TX->LCD显示器控制
- USART2 - RX->TVOC检测模块数据
- USART3 - GPS模块
- (near J3#2) TVOC
- (near J4#2) GPS
- (near J5#2) SWD
- (in symbol DC2.1mm) 插座
- (in symbol LN1134) TN1134

### Library data of the parts
C1#2 C2#2 C5#2 C7#2 C8#2 C11#2 C13#2 C14#2 C17#2 C22#2 C25#2 C27#2 C28#2 = Cap Pol1: Polarized Capacitor (Radial); Value: 1uF/16V; Published: 8-Jun-2000; LatestRevisionDate: 17-Jul-2002; LatestRevisionNote: Re-released for DXP Platform.; PackageReference: RB7.6-15; Publisher: Altium Limited
C3#2 C4#2 C6#2 C9#2 C10#2 C12#2 C15#2 C16#2 C18#2 C19#2 C20#2 C21#2 C23#2 C24#2 C26#2 C31 C32 C34-C37 = Cap: Capacitor; Published: 8-Jun-2000; LatestRevisionDate: 17-Jul-2002; LatestRevisionNote: Re-released for DXP Platform.; PackageReference: RAD-0.3; Publisher: Altium Limited; Value: 0.1uF
C29#2 C30 = Cap: Capacitor; Value: 22pF; Published: 8-Jun-2000; LatestRevisionDate: 17-Jul-2002; LatestRevisionNote: Re-released for DXP Platform.; PackageReference: RAD-0.3; Publisher: Altium Limited
C33 = Cap Pol1: Polarized Capacitor (Radial); Published: 8-Jun-2000; LatestRevisionDate: 17-Jul-2002; LatestRevisionNote: Re-released for DXP Platform.; PackageReference: RB7.6-15; Publisher: Altium Limited; Value: 4.7uF/16V
D1#2 D2 D3 = D Schottky: Schottky Diode; Published: 8-Jun-2000; LatestRevisionDate: 17-Jul-2002; LatestRevisionNote: Re-released for DXP Platform.; PackageReference: SMB; Publisher: Altium Limited; PackageDescription: DO-214-AA/SMB; 2 C-Bend Leads; Body 5.3 x 3.6 mm, inc. leads (LxW); Code_JEDEC: DO-214-AA
F1#2 F2 = Fuse 1: Fuse; Published: 8-Jun-2000; LatestRevisionDate: 17-Jul-2002; LatestRevisionNote: Re-released for DXP Platform.; PackageReference: PIN-W2/E2.8; Publisher: Altium Limited; PackageDescription: Thru-Hole; 2 Leads
H1 = DC2.1mm: 电池电源插座
J1#2 J2#2 J3#2 J4#2 J5#2 = Header 4: Header, 4-Pin; LatestRevisionDate: 17-Jul-2002; LatestRevisionNote: Re-released for DXP Platform.; Publisher: Altium Limited
JP1 = CON2
JR1#2 = Res1: Resistor; Value: 0; Published: 8-Jun-2000; LatestRevisionDate: 17-Jul-2002; LatestRevisionNote: Re-released for DXP Platform.; PackageReference: AXIAL-0.3; Publisher: Altium Limited; PackageDescription: Axial Device, Thru-Hole; 2 Leads; 0.3 in Pin Spacing
L1 = Inductor: Code_IEC: 1005; Published: 8-Jun-2000; LatestRevisionDate: 29-May-2009; LatestRevisionNote: IPC-7351 Footprint Added.; PackageReference: 0402-A; Publisher: Altium Limited; PackageDescription: Chip Inductor; Code_JEITA: 0402
LS1#2 = Bell: Electrical Bell; Published: 24-Mar-1999; LatestRevisionDate: 17-Jul-2002; LatestRevisionNote: Re-released for DXP Platform.; PackageReference: PIN2; Publisher: Altium Limited
Q1#2 Q2#2 Q3#2 Q4#2 Q5#2 = NPN: NPN Bipolar Transistor; Published: 8-Jun-2000; LatestRevisionDate: 17-Jul-2002; LatestRevisionNote: Re-released for DXP Platform.; PackageReference: TO-226-AA; Publisher: Altium Limited; PackageDescription: TO, Flat Index; 3 In-Line, Axial Leads; Body Dia. 4.8mm; Leads 0.55 x 0.51 mm (max); Code_JEDEC: TO-226-AA
R1#2 R2#2 R3#2 R15#2 R16#2 R17#2 R24#2 R43#2 = Res3: Resistor; Value: 10K; Published: 8-Jun-2000; LatestRevisionDate: 29-May-2009; LatestRevisionNote: IPC-7351 Footprint Added.; PackageReference: J1-0603; Publisher: Altium Limited; PackageDescription: Chip Resistor
R4#2 = Res3: Resistor; Value: 1K; Published: 8-Jun-2000; LatestRevisionDate: 29-May-2009; LatestRevisionNote: IPC-7351 Footprint Added.; PackageReference: J1-0603; Publisher: Altium Limited; PackageDescription: Chip Resistor
R5#2 R6#2 = Res3: Resistor; Value: 180; Published: 8-Jun-2000; LatestRevisionDate: 29-May-2009; LatestRevisionNote: IPC-7351 Footprint Added.; PackageReference: J1-0603; Publisher: Altium Limited; PackageDescription: Chip Resistor
R7#2 = Res3: Resistor; Value: 150; Published: 8-Jun-2000; LatestRevisionDate: 29-May-2009; LatestRevisionNote: IPC-7351 Footprint Added.; PackageReference: J1-0603; Publisher: Altium Limited; PackageDescription: Chip Resistor
R8#2 R9#2 R10#2 R12#2 R13#2 R14#2 R18#2 R19#2 R20#2 R21#2 R22#2 R23#2 R25#2 R26#2 R27#2 R28#2 R29#2 R30#2 R31#2 R32#2 R33#2 R34#2 R35#2 R36#2 R37#2 R38#2 R39#2 R40#2 R41#2 R42#2 = Res3: Resistor; Published: 8-Jun-2000; LatestRevisionDate: 29-May-2009; LatestRevisionNote: IPC-7351 Footprint Added.; PackageReference: J1-0603; Publisher: Altium Limited; PackageDescription: Chip Resistor
  R8#2 R9#2 R10#2 R18#2 R28#2 R40#2 R41#2: Value: 4.7K
  R12#2 R13#2 R14#2 R19#2 R42#2: Value: 3.3K
  R20#2 R21#2 R22#2 R23#2 R25#2 R34#2 R35#2 R36#2: Value: 10K
  R26#2 R27#2 R29#2 R30#2 R31#2 R32#2 R37#2 R39#2: Value: 120
  R33#2 R38#2: Value: 1K
S1#2 S2#2 = SW-PB: Switch; Published: 24-Mar-1999; LatestRevisionDate: 17-Jul-2002; LatestRevisionNote: Re-released for DXP Platform.; PackageReference: SPST-2; Publisher: Altium Limited; PackageDescription: Switch; 2 Leads
SW1 = Switch_3
T1#2 T2#2 T3#2 = TEST_POINT
U1#2 = 5MM-LED
U2#2 U4#2 U6 = SE8117: 降压稳压芯片，该系列最大1A输出
U3#2 = PMOS: 单个PMOS
U5 = ME2159: 单节锂电池升压芯片，最大12V
U8 = LN1134: 3.3V LDO
U9 = ME4057: 单节锂电池充电芯片
U10 = STM32F101C8T6: as U3#1 on sheet MavSword_V1.0; Published: 30-May-2008; DatasheetVersion: rev6, Mar-2008; PackageVersion: Mar-2008; PackageReference: LQFP48; Publisher: Altium Limited; PackageDescription: 48-Pin Low-Profile Quad Flat Pack, 7 x 7 mm Body, 0.5 mm Pitch (LQFP48); ComponentLink1Description: Manufacturer Link; ComponentLink1URL: www.st.com/stm32; ComponentLink2Description: Datasheet; ComponentLink2URL: http://www.st.com/stonline/products/literature/ds/13586.pdf
XTAL1#2 = XTAL: Crystal Oscillator; Published: 8-Jun-2000; LatestRevisionDate: 17-Jul-2002; LatestRevisionNote: Re-released for DXP Platform.; PackageReference: R38; Publisher: Altium Limited

## Nets that join several sheets
3V3-STM: MavSword_V1.0 (36 pins), Car (22 pins)
GND: MavSword_V1.0 (76 pins), hotV1.1 (7 pins), Car (77 pins)
VAGND: MavSword_V1.0 (JR1#1.1 U3#1.8), Car (JR1#2.1 U10.8)
BEEP: MavSword_V1.0 (R34#1.2 U3#1.18), Car (R18#2.2 U10.41)
BOOT0: MavSword_V1.0 (R37#1.2 U3#1.44), Car (R34#2.2 U10.44)
BOOT1: MavSword_V1.0 (R39#1.2 U3#1.20), Car (R36#2.2 U10.20)
CAL_KEY: MavSword_V1.0 (C20#1.2 R42#1.2 S2#1.1 U3#1.10), Car (C31.2 R28#2.2 S1#2.1 U10.10)
LED: MavSword_V1.0 (R40#1.2 U3#1.19), Car (R38#2.2 U10.19)
RGB1_BLUE: MavSword_V1.0 (R24#1.1 U3#1.27), Car (R8#2.1 U10.27)
RGB1_GRE: MavSword_V1.0 (R25#1.2 U3#1.26), Car (R9#2.2 U10.26)
RGB1_RED: MavSword_V1.0 (R26#1.2 U3#1.25), Car (R10#2.2 U10.25)
RST: MavSword_V1.0 (C12#1.2 R38#1.2 S1#1.2 U3#1.7), Car (C32.2 R35#2.2 S2#2.2 U10.7)
RXD1: MavSword_V1.0 (R1#1.2 U3#1.31), Car (R26#2.2 U10.31)
RXD2: MavSword_V1.0 (R13#1.2 U3#1.13), Car (R29#2.2 R31#2.2 U10.13)
RXD3: MavSword_V1.0 (R18#1.2 U3#1.22), Car (R37#2.2 U10.22)
SCL: MavSword_V1.0 (OLED1.18 R46.1 U3#1.42), Car (U10.42)
SDA: MavSword_V1.0 (OLED1.19 OLED1.20 R48.1 U3#1.43), Car (U10.43)
SWCLK: MavSword_V1.0 (J5#1.2 U3#1.37), Car (J5#2.2 U10.37)
SWDIO: MavSword_V1.0 (J5#1.3 U3#1.34), Car (J5#2.3 U10.34)
TXD1: MavSword_V1.0 (R4#1.2 U3#1.30), Car (R27#2.2 U10.30)
TXD2: MavSword_V1.0 (R15#1.2 U3#1.12), Car (R30#2.2 R32#2.2 U10.12)
TXD3: MavSword_V1.0 (R20#1.2 U3#1.21), Car (R39#2.2 U10.21)
USB_DM: MavSword_V1.0 (R32#1.2 U3#1.32), Car (U10.32)
USB_DP: MavSword_V1.0 (R33#1.2 U3#1.33), Car (U10.33)